# Altium schematic sheet GR.SchDoc
size A
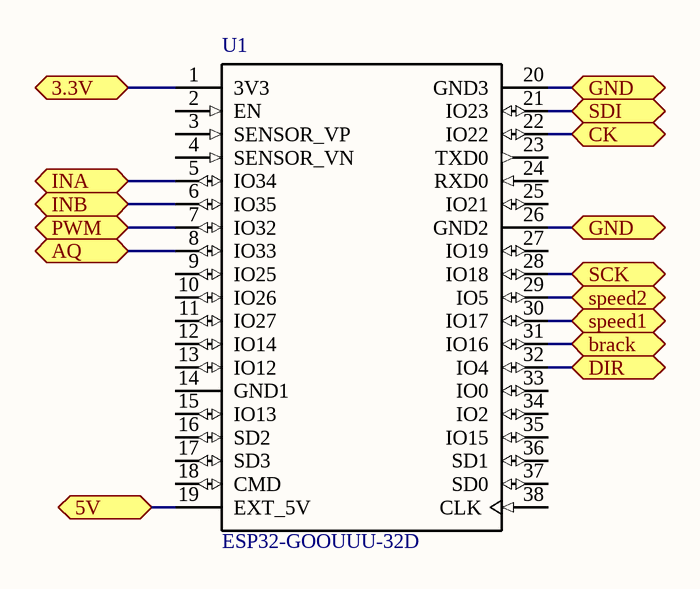
[diagram p0: GR.SchDoc]

## Parts
U1  ESP32-GOOUUU-32D  [ESP32-GOOUUU-32D]

## Ports
3.3V (bidir), 5V (bidir), AQ (bidir), brack (bidir), CK (bidir), DIR (bidir), GND (bidir), INA (bidir), INB (bidir), PWM (bidir), SCK (bidir), SDI (bidir), speed1 (bidir), speed2 (bidir)

## Nets
3.3V: U1.1(3V3) ; port 3.3V
5V: U1.19(EXT_5V) ; port 5V
AQ: U1.8(IO33) ; port AQ
brack: U1.31(IO16) ; port brack
CK: U1.22(IO22) ; port CK
DIR: U1.32(IO4) ; port DIR
GND: U1.20(GND3) U1.26(GND2) ; port GND
INA: U1.5(IO34) ; port INA
INB: U1.6(IO35) ; port INB
PWM: U1.7(IO32) ; port PWM
SCK: U1.28(IO18) ; port SCK
SDI: U1.21(IO23) ; port SDI
speed1: U1.30(IO17) ; port speed1
speed2: U1.29(IO5) ; port speed2

Not connected (* = marked no-connect by the designer): U1 2(EN) 3(SENSOR_VP) 4(SENSOR_VN) 9(IO25) 10(IO26) 11(IO27) 12(IO14) 13(IO12) 14(GND1) 15(IO13) 16(SD2) 17(SD3) 18(CMD) 23(TXD0) 24(RXD0) 25(IO21) 27(IO19) 33(IO0) 34(IO2) 35(IO15) 36(SD1) 37(SD0) 38(CLK)

## Library data of the parts
U1 = ESP32-GOOUUU-32D: Eval Board For Esp-Wroom-32; MP: ESP32-DEVKITC-32D; MF: Espressif Systems; Price: None; Availability: Unavailable; SnapEDA_Link: https://www.snapeda.com/parts/ESP32-DEVKITC-32D/Espressif%20Systems/view-part/?ref=snap; Package: None; Value: *